# EAGLE design connector_cable (EAGLE 9.3.0)
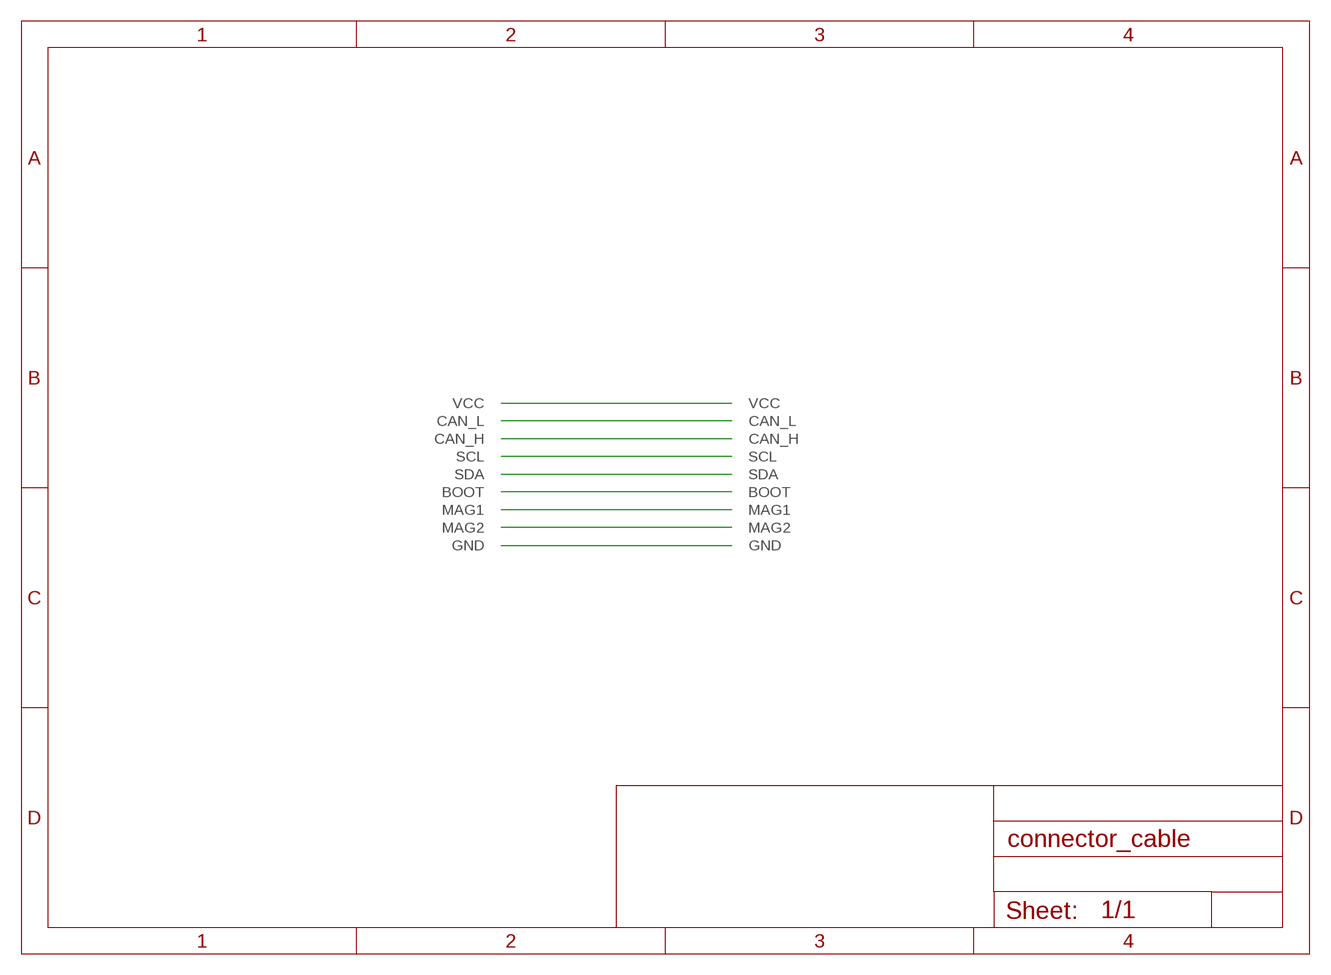
[diagram p0: schematic, sheet 1]

## Parts
U$2  FLEX-CARD_CONN  [10-8_STAGGERED-PAD_CARD_SIDE_FLEX_CONN]
U$3  FLEX-DRIVER_CONN  [20-PAD_DRIVER_SIDE_FLEX_CONN]

## Nets
BOOT: U$2.BOOT1(BOOT) U$2.BOOT2(BOOT) U$3.BOOT
CAN_H: U$2.CAN_H1(CAN_H) U$2.CAN_H2(CAN_H) U$3.CAN_H
CAN_L: U$2.CAN_L1(CAN_L) U$2.CAN_L2(CAN_L) U$3.CAN_L
GND: U$2.GND1(GND) U$2.GND2(GND) U$2.GND3(GND) U$2.GND4(GND) U$2.GND5(GND) U$2.GND6(GND) U$2.GND7(GND) U$2.GND8(GND) U$2.GND9(GND) U$2.GND10(GND) U$2.GND11(GND) U$2.GND12(GND) U$3.GND1(GND) U$3.GND2(GND) U$3.GND3(GND) U$3.GND4(GND) U$3.GND5(GND) U$3.GND6(GND) U$3.GND7(GND) U$3.GND8(GND) U$3.GND9(GND)
MAG1: U$2.MAG11(MAG1) U$2.MAG12(MAG1) U$3.MAG1
MAG2: U$2.MAG21(MAG2) U$2.MAG22(MAG2) U$3.MAG2
SCL: U$2.SCL1(SCL) U$2.SCL2(SCL) U$3.SCL
SDA: U$2.SDA1(SDA) U$2.SDA2(SDA) U$3.SDA
VCC: U$2.VCC1(VCC) U$2.VCC2(VCC) U$2.VCC3(VCC) U$2.VCC4(VCC) U$2.VCC5(VCC) U$2.VCC6(VCC) U$3.VCC1(VCC) U$3.VCC2(VCC) U$3.VCC3(VCC) U$3.VCC4(VCC)

## Library data of the parts
U$2 = oresat-ACS_driver_board:FLEX-CARD_CONN
U$3 = oresat-ACS_driver_board:FLEX-DRIVER_CONN

## Board
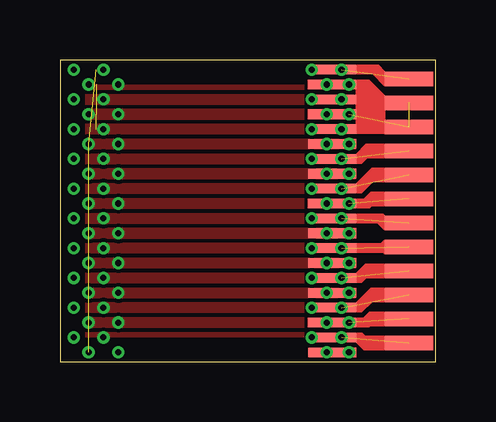
[diagram p1: board, top side]
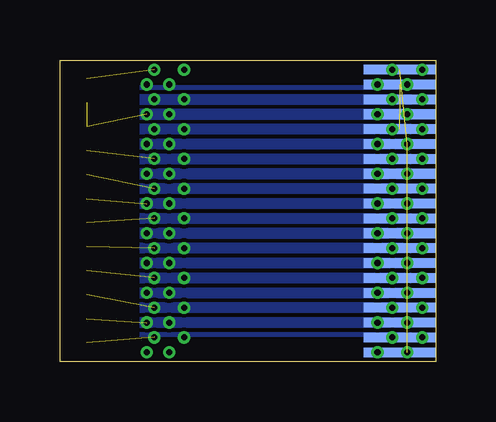
[diagram p2: board, bottom side, seen from below]

Size 15.66 x 12.58 mm. Coordinates in mm from the lower left corner, seen from the top.
Outline: 0,0 15.66,0 15.66,12.58 0,12.58 0,0
Copper layers (1*16): Top 0.035559375mm / dielectric 4mil / Bottom 0.035559375mm
Design rules "default *": minimum track width 6mil, minimum drill 10mil, track to track 6mil, track to pad 6mil, pad to pad 6mil, via to via 6mil, smd to smd 6mil, copper to edge 40mil, drill to drill 6mil, minimum pad ring 5mil, minimum via ring 5mil, stop-mask expansion 4mil, vias tented up to drill 15mil, thermal gap 10mil

### Footprints (pad centres in the part's own frame; a part is rotated, then mirrored left to right if it is on the bottom)
10-8_STAGGERED-PAD_CARD_SIDE_FLEX_CONN = smd 2 x 0.4: BOOT1 -0.7,-2.79; CAN_H1 -0.7,0.93; CAN_L1 -0.7,2.17; GND1 -0.7,5.89; GND2 -0.7,2.79; GND3 -0.7,1.55; GND4 -0.7,0.31; GND5 -0.7,-0.93; GND6 -0.7,-2.17; GND7 -0.7,-3.41; GND8 -0.7,-4.65; GND9 -0.7,-5.89; MAG11 -0.7,-4.03; MAG21 -0.7,-5.27; SCL1 -0.7,-0.31; SDA1 -0.7,-1.55; VCC1 -0.7,5.27; VCC2 -0.7,4.65; VCC3 -0.7,4.03; VCC4 -0.7,3.41 | smd 2 x 0.6: BOOT2 2.5,-2.5; CAN_H2 2.5,1.5; CAN_L2 2.5,2.5; GND10 2.5,5.5; GND11 2.5,0.5; GND12 2.5,-4.5; MAG12 2.5,-3.5; MAG22 2.5,-5.5; SCL2 2.5,-0.5; SDA2 2.5,-1.5; VCC5 2.5,4.5; VCC6 2.5,3.5
20-PAD_DRIVER_SIDE_FLEX_CONN = smd 3 x 0.4: BOOT 0,-2.79; CAN_H 0,0.93; CAN_L 0,2.17; GND1 0,5.89; GND2 0,2.79; GND3 0,1.55; GND4 0,0.31; GND5 0,-0.93; GND6 0,-2.17; GND7 0,-3.41; GND8 0,-4.65; GND9 0,-5.89; MAG1 0,-4.03; MAG2 0,-5.27; SCL 0,-0.31; SDA 0,-1.55; VCC1 0,5.27; VCC2 0,4.65; VCC3 0,4.03; VCC4 0,3.41

### Placement (x,y rotation side)
U$2  12.04,6.29 0 top
U$3  1.5,6.29 0 bottom

### Tracks (layer width: path | path; a pad name or v marks a point on that pad's centre or on a via)
BOOT  (via drill 0.25)  (1 unrouted)
  other vias: 0.57,3.5 1.81,3.5 11.73,3.5 10.49,3.5
  pour Top (no thermals): 0,3.7 0,3.3 12.34,3.3 12.34,3.7
  pour Bottom (no thermals): 0,3.7 12.34,3.7 12.34,3.3 0,3.3
CAN_H  (via drill 0.25)  (1 unrouted)
  other vias: 1.81,7.22 0.57,7.22 11.73,7.22 10.49,7.22
  pour Top (no thermals): 0,7.42 0,7.02 12.34,7.02 12.34,7.42
  pour Bottom (no thermals): 0,7.42 12.34,7.42 12.34,7.02 0,7.02
CAN_L  (via drill 0.25)  (1 unrouted)
  other vias: 1.81,8.46 0.57,8.46 10.49,8.46 11.73,8.46
  pour Top (no thermals): 0,8.66 0,8.26 12.34,8.26 12.34,8.66
  pour Bottom (no thermals): 0,8.66 12.34,8.66 12.34,8.26 0,8.26
GND  (via drill 0.25)  (11 unrouted)
  other vias: 1.19,9.08 1.19,7.84 1.19,6.6 1.19,5.36 1.19,4.12 1.19,2.88 1.19,1.64 1.19,0.4 0.57,12.18 1.81,12.18 2.43,9.08 2.43,7.84 2.43,6.6 2.43,5.36 2.43,4.12 2.43,2.88 2.43,1.64 2.43,0.4 10.49,12.18 11.73,12.18 11.11,9.08 12.04,9.08 11.11,7.84 12.04,7.84 11.11,6.6 12.04,6.6 11.11,5.36 12.04,5.36 11.11,4.12 12.04,4.12 11.11,2.88 12.04,2.88 11.11,1.64 12.04,1.64 11.11,0.4 12.04,0.4
  pour Bottom (no thermals): 0,12.38 12.34,12.38 12.34,11.98 0,11.98
  pour Bottom (no thermals): 0,9.28 12.34,9.28 12.34,8.88 0,8.88
  pour Bottom (no thermals): 0,8.04 12.34,8.04 12.34,7.64 0,7.64
  pour Bottom (no thermals): 0,6.8 12.34,6.8 12.34,6.4 0,6.4
  pour Bottom (no thermals): 0,5.56 12.34,5.56 12.34,5.16 0,5.16
  pour Bottom (no thermals): 0,4.32 12.34,4.32 12.34,3.92 0,3.92
  pour Bottom (no thermals): 0,3.08 12.34,3.08 12.34,2.68 0,2.68
  pour Bottom (no thermals): 0,1.84 12.34,1.84 12.34,1.44 0,1.44
  pour Bottom (no thermals): 0,0.6 12.34,0.6 12.34,0.2 0,0.2
  pour Top (no thermals): 0,12.38 0,11.98 12.34,11.98 12.34,12.38
  pour Top (no thermals): 0,9.28 0,8.88 12.34,8.88 12.34,9.28
  pour Top (no thermals): 0,8.04 0,7.64 12.34,7.64 12.34,8.04
  pour Top (no thermals): 0,6.8 0,6.4 12.34,6.4 12.34,6.8
  pour Top (no thermals): 0,5.56 0,5.16 12.34,5.16 12.34,5.56
  pour Top (no thermals): 0,4.32 0,3.92 12.34,3.92 12.34,4.32
  pour Top (no thermals): 0,3.08 0,2.68 12.34,2.68 12.34,3.08
  pour Top (no thermals): 0,1.84 0,1.44 12.34,1.44 12.34,1.84
  pour Top (no thermals): 0,0.6 0,0.2 12.34,0.2 12.34,0.6
MAG1  (via drill 0.25)  (1 unrouted)
  other vias: 0.57,2.26 1.81,2.26 11.73,2.26 10.49,2.26
  pour Top (no thermals): 0,2.46 0,2.06 12.34,2.06 12.34,2.46
  pour Bottom (no thermals): 0,2.46 12.34,2.46 12.34,2.06 0,2.06
MAG2  (via drill 0.25)  (1 unrouted)
  other vias: 1.81,1.02 0.57,1.02 11.73,1.02 10.49,1.02
  pour Top (no thermals): 0,1.22 0,0.82 12.34,0.82 12.34,1.22
  pour Bottom (no thermals): 0,1.22 12.34,1.22 12.34,0.82 0,0.82
SCL  (via drill 0.25)  (1 unrouted)
  other vias: 0.57,5.98 1.81,5.98 11.73,5.98 10.49,5.98
  pour Top (no thermals): 0,6.18 0,5.78 12.34,5.78 12.34,6.18
  pour Bottom (no thermals): 0,6.18 12.34,6.18 12.34,5.78 0,5.78
SDA  (via drill 0.25)  (1 unrouted)
  other vias: 1.81,4.74 0.57,4.74 11.73,4.74 10.49,4.74
  pour Top (no thermals): 0,4.94 0,4.54 12.34,4.54 12.34,4.94
  pour Bottom (no thermals): 0,4.94 12.34,4.94 12.34,4.54 0,4.54
VCC  (via drill 0.25)  (5 unrouted)
  other vias: 1.19,11.56 1.19,10.32 0.57,10.94 1.81,10.94 2.43,11.56 2.43,10.32 0.57,9.7 1.81,9.7 11.11,11.56 12.04,11.56 11.73,10.94 10.49,10.94 11.11,10.32 12.04,10.32 10.49,9.7 11.73,9.7
  pour Top (no thermals): 0,9.9 0,9.5 12.34,9.5 12.34,9.9
  pour Top (no thermals): 0,10.52 0,10.12 12.34,10.12 12.34,10.52
  pour Top (no thermals): 0,11.14 0,10.74 12.34,10.74 12.34,11.14
  pour Top (no thermals): 0,11.76 0,11.36 12.34,11.36 12.34,11.76
  pour Bottom (no thermals): 0,9.9 12.34,9.9 12.34,9.5 0,9.5
  pour Bottom (no thermals): 0,10.52 12.34,10.52 12.34,10.12 0,10.12
  pour Bottom (no thermals): 0,11.14 12.34,11.14 12.34,10.74 0,10.74
  pour Bottom (no thermals): 0,11.76 12.34,11.76 12.34,11.36 0,11.36